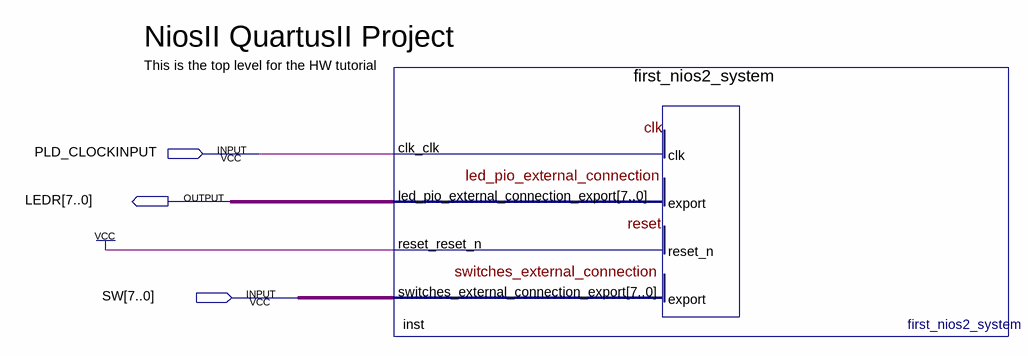
[diagram p0: schematic sheet]
// Quartus schematic nios2_quartus2_project.bdf as structural Verilog: 1 symbols, 3 pins
module nios2_quartus2_project (
  input  PLD_CLOCKINPUT,
  input  [7:0] SW,
  output [7:0] LEDR
);

  first_nios2_system inst (
    .clk_clk(PLD_CLOCKINPUT), .reset_reset_n(1'b1), .switches_external_connection_export(SW),
    .led_pio_external_connection_export(LEDR));

  // Notes on the sheet:
  //   NiosII QuartusII Project
  //   This is the top level for the HW tutorial
endmodule
